# Altium project LGE_670W_L6790A Single Stage PFC LLC TV Power.PrjPcb
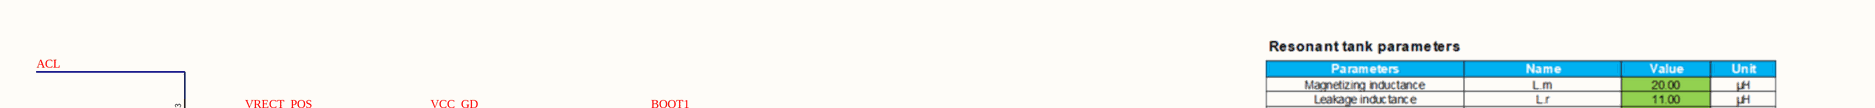
[diagram p0: L6790A_GaN.SchDoc, top left]
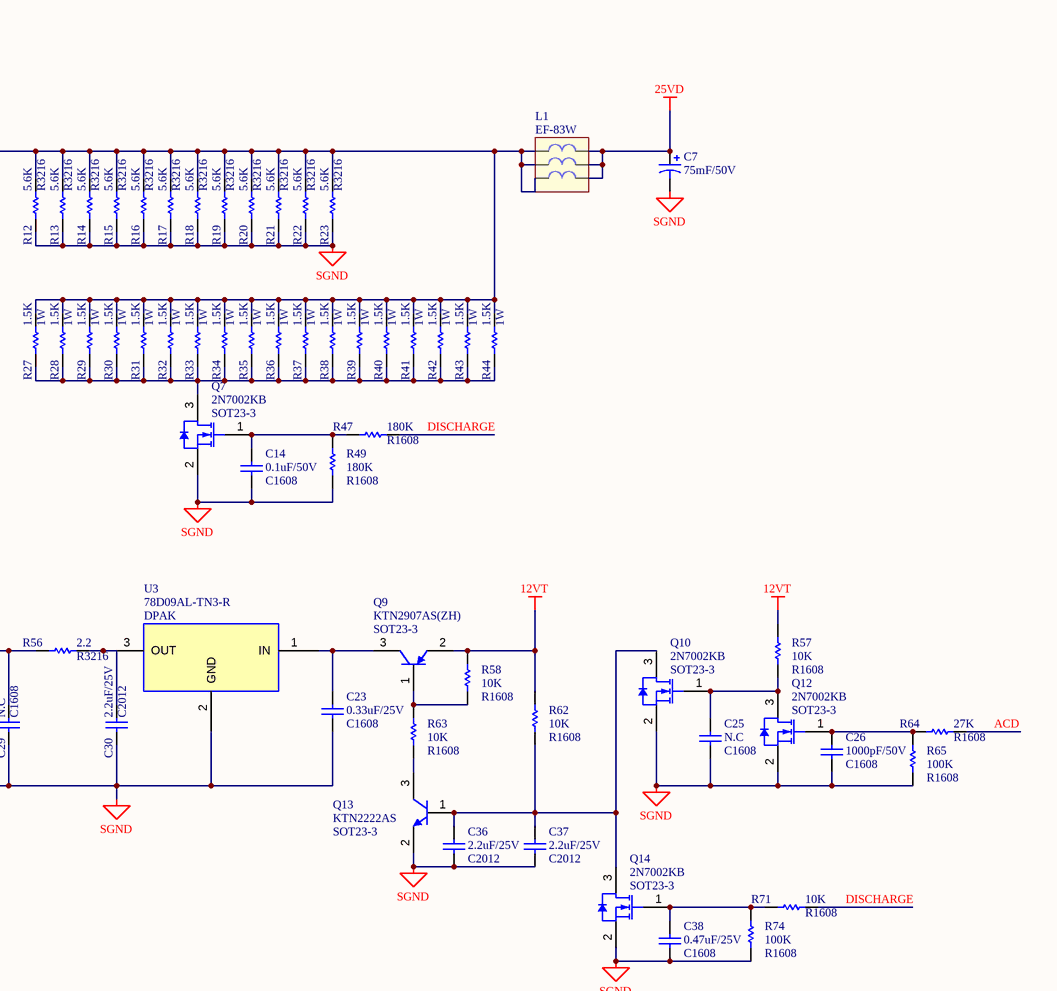
[diagram p1: L6790A_GaN.SchDoc, top right]
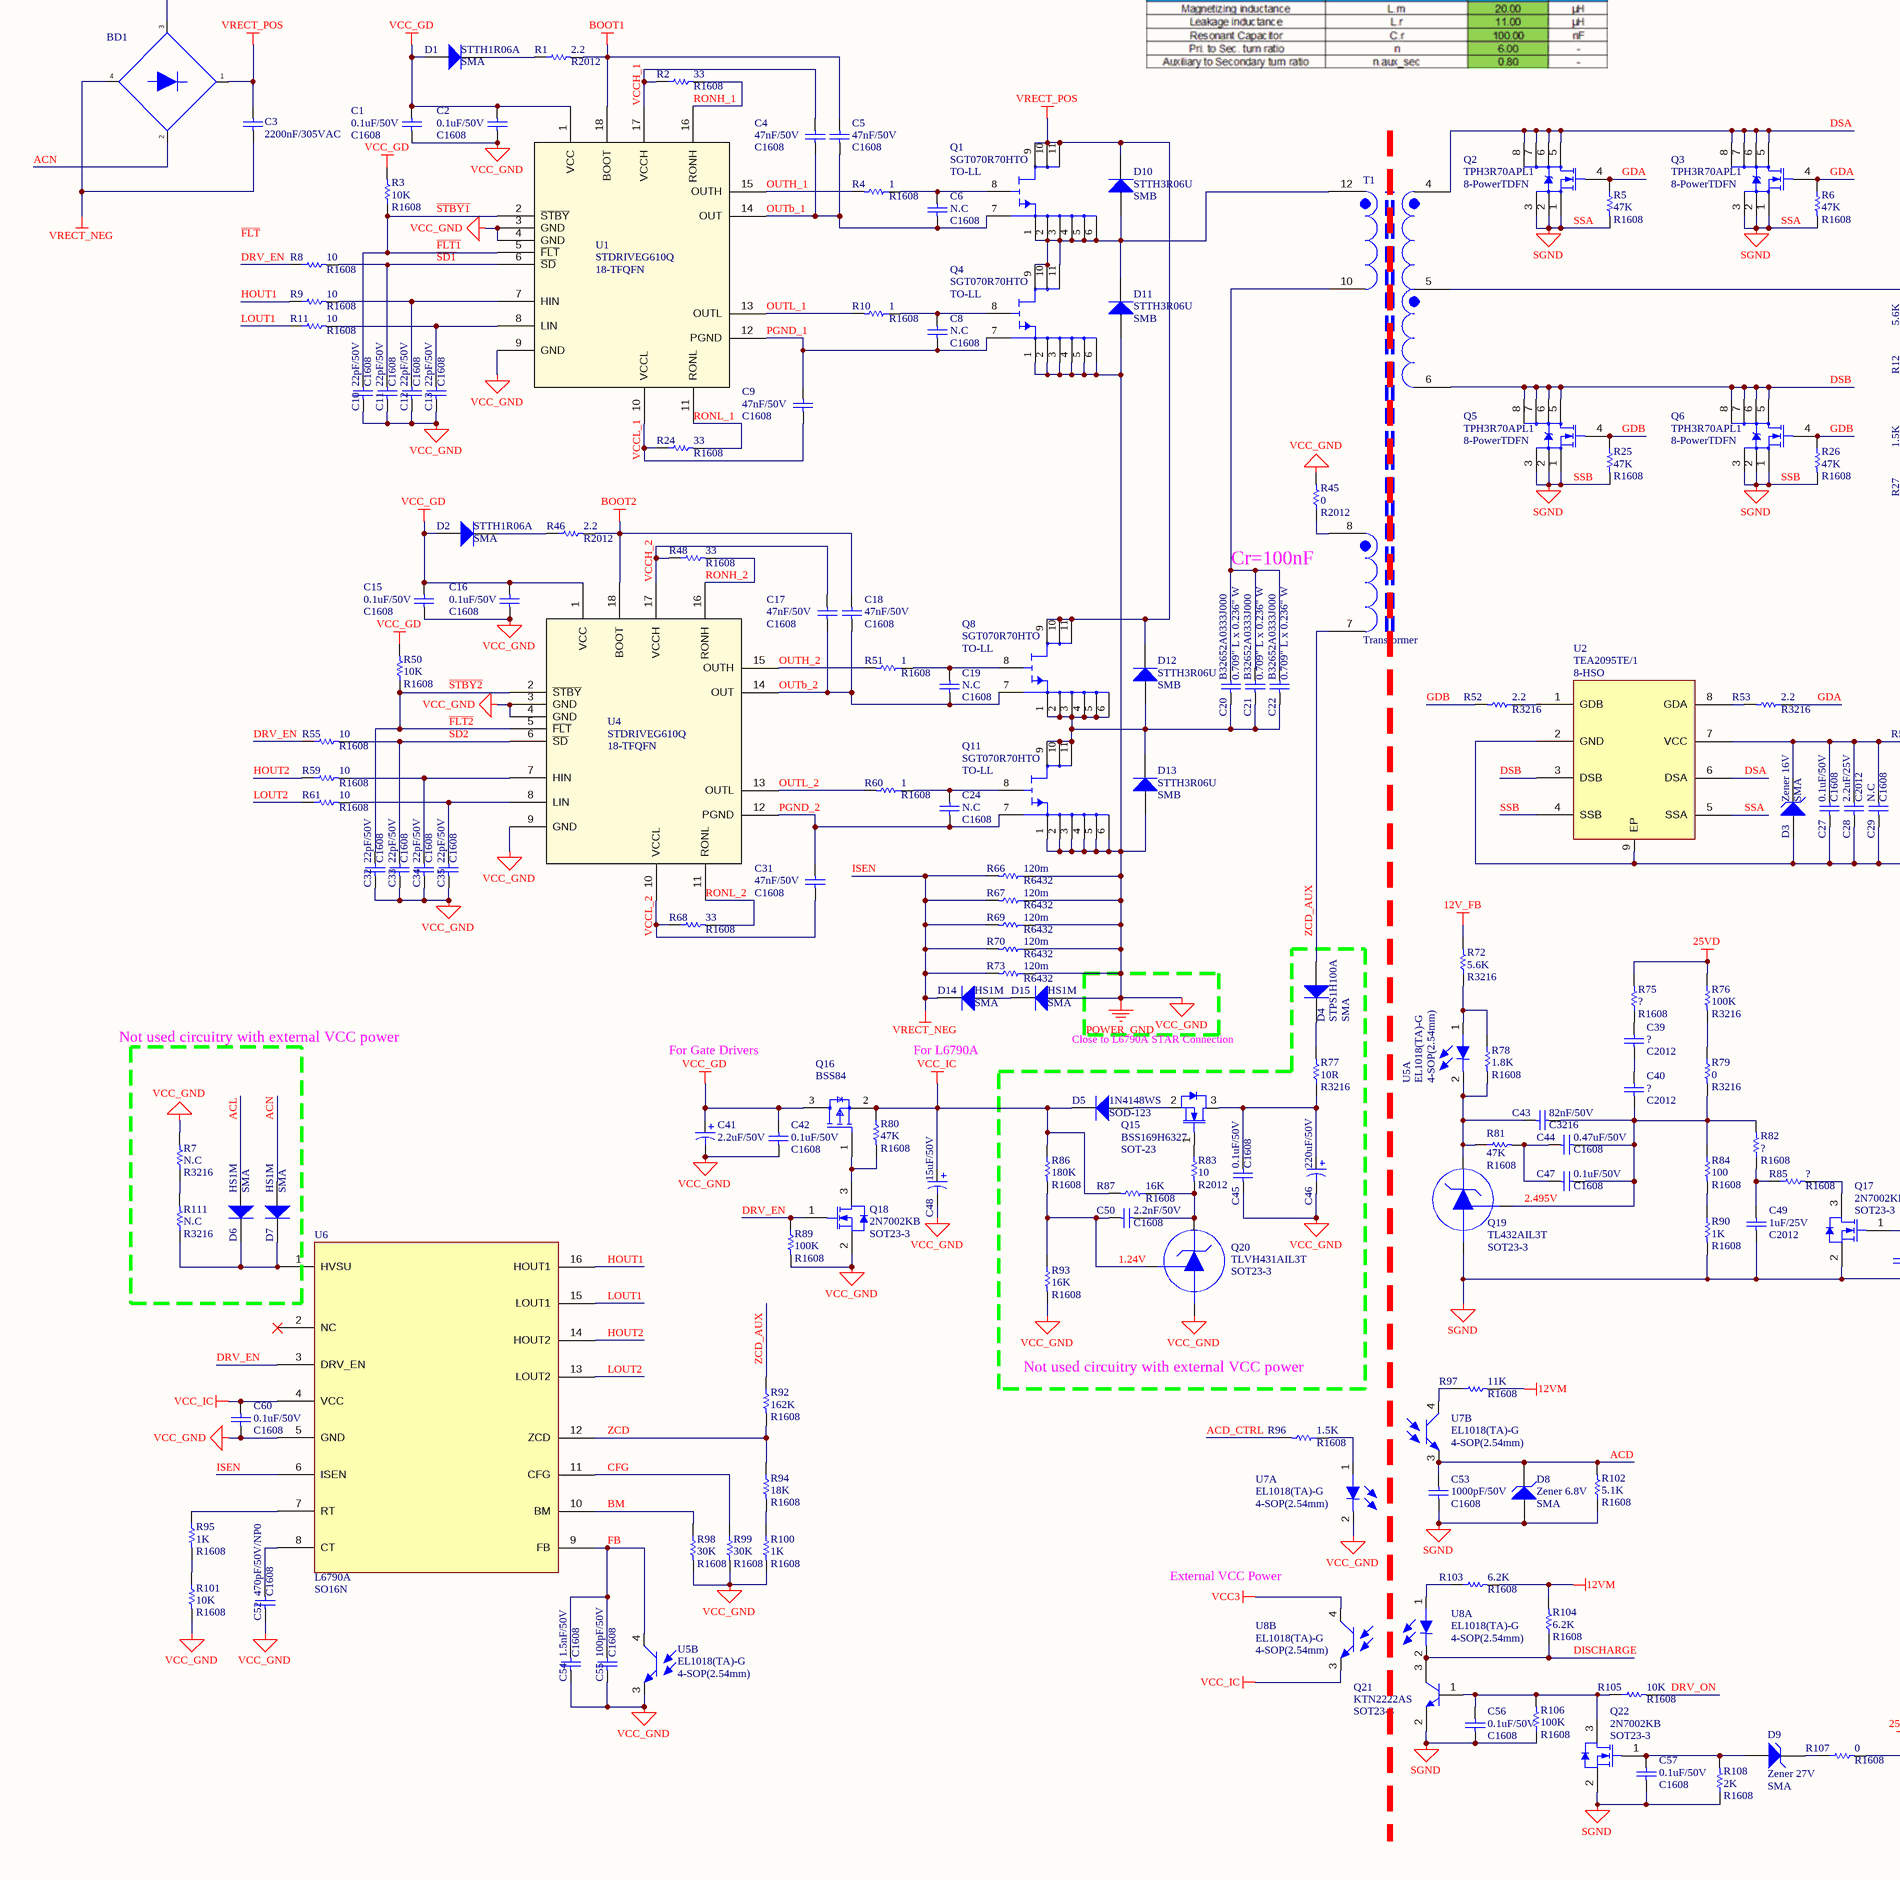
[diagram p2: L6790A_GaN.SchDoc, bottom left]
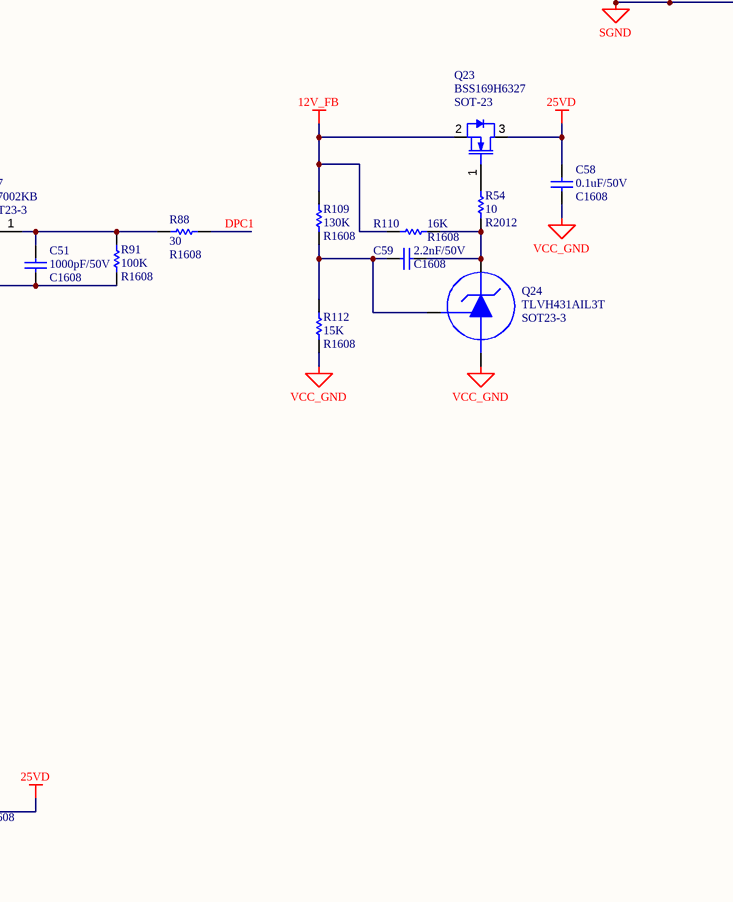
[diagram p3: L6790A_GaN.SchDoc, bottom right]
2 sheets, 445 parts. Net scope: global (net labels, ports and power ports of the same name join across sheets).
Sheets:
  L6790A_GaN.SchDoc
  L6790A_Si.SchDoc

## Sheet L6790A_GaN.SchDoc
size 594 x 420 mm; Author: Frank KWON; CompanyName: STMicroelectronics; DrawnBy: Frank KWON; Engineer: Frank KWON; Organization: AM&S APeC Korea; SheetNumber: 1; SheetTotal: 2

### Parts
BD1  TS6KL60  [2W-DIO-MI-4L-4_6X25X15-7_5P-BD]  (value not drawn)
C1  0.1uF/50V  Package/Case: C1608
C2  0.1uF/50V  Package/Case: C1608
C3  2200nF/305VAC
C4  47nF/50V  Package/Case: C1608
C5  47nF/50V  Package/Case: C1608
C6  N.C  Package/Case: C1608
C7  75mF/50V  [1W-CAP-MI-2L-16DX25-7_5P-EL-F-R1212]
C8  N.C  Package/Case: C1608
C9  47nF/50V  Package/Case: C1608
C10  22pF/50V  Package/Case: C1608
C11  22pF/50V  Package/Case: C1608
C12  22pF/50V  Package/Case: C1608
C13  22pF/50V  Package/Case: C1608
C14  0.1uF/50V  Package/Case: C1608
C15  0.1uF/50V  Package/Case: C1608
C16  0.1uF/50V  Package/Case: C1608
C17  47nF/50V  Package/Case: C1608
C18  47nF/50V  Package/Case: C1608
C19  N.C  Package/Case: C1608
C20  B32652A0333J000  Package/Case: 0.709" L x 0.236" W
C21  B32652A0333J000  Package/Case: 0.709" L x 0.236" W
C22  B32652A0333J000  Package/Case: 0.709" L x 0.236" W
C23  0.33uF/25V  Package/Case: C1608
C24  N.C  Package/Case: C1608
C25  N.C  Package/Case: C1608
C26  1000pF/50V  Package/Case: C1608
C27  0.1uF/50V  Package/Case: C1608
C28  2.2uF/25V  Package/Case: C2012
C29  N.C  Package/Case: C1608
C30  2.2uF/25V  Package/Case: C2012
C31  47nF/50V  Package/Case: C1608
C32  22pF/50V  Package/Case: C1608
C33  22pF/50V  Package/Case: C1608
C34  22pF/50V  Package/Case: C1608
C35  22pF/50V  Package/Case: C1608
C36  2.2uF/25V  Package/Case: C2012
C37  2.2uF/25V  Package/Case: C2012
C38  0.47uF/25V  Package/Case: C1608
C39  ?  Package/Case: C2012
C40  ?  Package/Case: C2012
C41  2.2uF/50V  [CAP-RA-D5.0H12_5-P2-R0CA]
C42  0.1uF/50V  Package/Case: C1608
C43  82nF/50V  Package/Case: C3216  [CAP-CHP-3216-R0]
C44  0.47uF/50V  Package/Case: C1608
C45  0.1uF/50V  Package/Case: C1608
C46  220uF/50V  [CAP-RA-D8H5-P2_5-R0]
C47  0.1uF/50V  Package/Case: C1608
C48  15uF/50V  [CAP-RA-D5.0H12_5-P2-R0CA]
C49  1uF/25V  Package/Case: C2012
C50  2.2nF/50V  Package/Case: C1608
C51  1000pF/50V  Package/Case: C1608
C52  470pF/50V/NP0  Package/Case: C1608
C53  1000pF/50V  Package/Case: C1608
C54  1.5nF/50V  Package/Case: C1608
C55  100pF/50V  Package/Case: C1608
C56  0.1uF/50V  Package/Case: C1608
C57  0.1uF/50V  Package/Case: C1608
C58  0.1uF/50V  Package/Case: C1608
C59  2.2nF/50V  Package/Case: C1608
C60  0.1uF/50V  Package/Case: C1608
D1  STTH1R06A  Package/Case: SMA  [DIO-SOD123]
D2  STTH1R06A  Package/Case: SMA  [DIO-SOD123]
D3  Zener 16V  Package/Case: SMA  [1W-DIO-CHP-2L-SOD106-SMA]
D4  STPS1H100A  Package/Case: SMA  [FP-6_560-5005_01-4-IPC_A]
D5  1N4148WS  Package/Case: SOD-123  [DIO-SOD123]
D6  HS1M  Package/Case: SMA  [DIO-SOD123]
D7  HS1M  Package/Case: SMA  [DIO-SOD123]
D8  Zener 6.8V  Package/Case: SMA  [1W-DIO-CHP-2L-SOD106-SMA]
D9  Zener 27V  Package/Case: SMA  [1W-DIO-CHP-2L-SOD106-SMA]
D10  STTH3R06U  Package/Case: SMB  [DIO-SOD123]
D11  STTH3R06U  Package/Case: SMB  [DIO-SOD123]
D12  STTH3R06U  Package/Case: SMB  [DIO-SOD123]
D13  STTH3R06U  Package/Case: SMB  [DIO-SOD123]
D14  HS1M  Package/Case: SMA  [DIO-SOD123]
D15  HS1M  Package/Case: SMA  [DIO-SOD123]
L1  EF-83W
Q1  SGT070R70HTO  Package/Case: TO-LL
Q2  TPH3R70APL1  Package/Case: 8-PowerTDFN
Q3  TPH3R70APL1  Package/Case: 8-PowerTDFN
Q4  SGT070R70HTO  Package/Case: TO-LL
Q5  TPH3R70APL1  Package/Case: 8-PowerTDFN
Q6  TPH3R70APL1  Package/Case: 8-PowerTDFN
Q7  2N7002KB  Package/Case: SOT23-3
Q8  SGT070R70HTO  Package/Case: TO-LL
Q9  KTN2907AS(ZH)  Package/Case: SOT23-3
Q10  2N7002KB  Package/Case: SOT23-3
Q11  SGT070R70HTO  Package/Case: TO-LL
Q12  2N7002KB  Package/Case: SOT23-3
Q13  KTN2222AS  Package/Case: SOT23-3
Q14  2N7002KB  Package/Case: SOT23-3
Q15  BSS169H6327  Package/Case: SOT-23  [SOT-23_TR]
Q16  BSS84  [FP-318-08-IPC_A]
Q17  2N7002KB  Package/Case: SOT23-3
Q18  2N7002KB  Package/Case: SOT23-3
Q19  TL432AIL3T  Package/Case: SOT23-3  [SOT-23_TR]
Q20  TLVH431AIL3T  Package/Case: SOT23-3  [SOT-23_TR]
Q21  KTN2222AS  Package/Case: SOT23-3
Q22  2N7002KB  Package/Case: SOT23-3
Q23  BSS169H6327  Package/Case: SOT-23  [SOT-23_TR]
Q24  TLVH431AIL3T  Package/Case: SOT23-3  [SOT-23_TR]
R1  2.2  Package/Case: R2012  [RES-1608]
R2  33  Package/Case: R1608  [RES-1608]
R3  10K  Package/Case: R1608  [RES-1608]
R4  1  Package/Case: R1608  [RES-1608]
R5  47K  Package/Case: R1608  [RES-1608]
R6  47K  Package/Case: R1608  [RES-1608]
R7  N.C  Package/Case: R3216  [RES-3216]
R8  10  Package/Case: R1608  [RES-1608]
R9  10  Package/Case: R1608  [RES-1608]
R10  1  Package/Case: R1608  [RES-1608]
R11  10  Package/Case: R1608  [RES-1608]
R12  5.6K  Package/Case: R3216  [RES-3216]
R13  5.6K  Package/Case: R3216  [RES-3216]
R14  5.6K  Package/Case: R3216  [RES-3216]
R15  5.6K  Package/Case: R3216  [RES-3216]
R16  5.6K  Package/Case: R3216  [RES-3216]
R17  5.6K  Package/Case: R3216  [RES-3216]
R18  5.6K  Package/Case: R3216  [RES-3216]
R19  5.6K  Package/Case: R3216  [RES-3216]
R20  5.6K  Package/Case: R3216  [RES-3216]
R21  5.6K  Package/Case: R3216  [RES-3216]
R22  5.6K  Package/Case: R3216  [RES-3216]
R23  5.6K  Package/Case: R3216  [RES-3216]
R24  33  Package/Case: R1608  [RES-1608]
R25  47K  Package/Case: R1608  [RES-1608]
R26  47K  Package/Case: R1608  [RES-1608]
R27  1.5K  Package/Case: 1W
R28  1.5K  Package/Case: 1W
R29  1.5K  Package/Case: 1W
R30  1.5K  Package/Case: 1W
R31  1.5K  Package/Case: 1W
R32  1.5K  Package/Case: 1W
R33  1.5K  Package/Case: 1W
R34  1.5K  Package/Case: 1W
R35  1.5K  Package/Case: 1W
R36  1.5K  Package/Case: 1W
R37  1.5K  Package/Case: 1W
R38  1.5K  Package/Case: 1W
R39  1.5K  Package/Case: 1W
R40  1.5K  Package/Case: 1W
R41  1.5K  Package/Case: 1W
R42  1.5K  Package/Case: 1W
R43  1.5K  Package/Case: 1W
R44  1.5K  Package/Case: 1W
R45  0  Package/Case: R2012  [RES-1608]
R46  2.2  Package/Case: R2012  [RES-1608]
R47  180K  Package/Case: R1608  [RES-1608]
R48  33  Package/Case: R1608  [RES-1608]
R49  180K  Package/Case: R1608  [RES-1608]
R50  10K  Package/Case: R1608  [RES-1608]
R51  1  Package/Case: R1608  [RES-1608]
R52  2.2  Package/Case: R3216  [RES-3216]
R53  2.2  Package/Case: R3216  [RES-3216]
R54  10  Package/Case: R2012  [RES-1608]
R55  10  Package/Case: R1608  [RES-1608]
R56  2.2  Package/Case: R3216  [RES-3216]
R57  10K  Package/Case: R1608  [RES-1608]
R58  10K  Package/Case: R1608  [RES-1608]
R59  10  Package/Case: R1608  [RES-1608]
R60  1  Package/Case: R1608  [RES-1608]
R61  10  Package/Case: R1608  [RES-1608]
R62  10K  Package/Case: R1608  [RES-1608]
R63  10K  Package/Case: R1608  [RES-1608]
R64  27K  Package/Case: R1608  [RES-1608]
R65  100K  Package/Case: R1608  [RES-1608]
R66  120m  Package/Case: R6432
R67  120m  Package/Case: R6432
R68  33  Package/Case: R1608  [RES-1608]
R69  120m  Package/Case: R6432
R70  120m  Package/Case: R6432
R71  10K  Package/Case: R1608  [RES-1608]
R72  5.6K  Package/Case: R3216  [RES-3216]
R73  120m  Package/Case: R6432
R74  100K  Package/Case: R1608  [RES-1608]
R75  ?  Package/Case: R1608  [RES-1608]
R76  100K  Package/Case: R3216  [RES-3216]
R77  10R  Package/Case: R3216  [RES-3216]
R78  1.8K  Package/Case: R1608  [RES-1608]
R79  0  Package/Case: R3216  [RES-3216]
R80  47K  Package/Case: R1608  [RES-1608]
R81  47K  Package/Case: R1608  [RES-1608]
R82  ?  Package/Case: R1608  [RES-1608]
R83  10  Package/Case: R2012  [RES-1608]
R84  100  Package/Case: R1608  [RES-1608]
R85  ?  Package/Case: R1608  [RES-1608]
R86  180K  Package/Case: R1608  [RES-1608]
R87  16K  Package/Case: R1608  [RES-1608]
R88  30  Package/Case: R1608  [RES-1608]
R89  100K  Package/Case: R1608  [RES-1608]
R90  1K  Package/Case: R1608  [RES-1608]
R91  100K  Package/Case: R1608  [RES-1608]
R92  162K  Package/Case: R1608  [RES-1608]
R93  16K  Package/Case: R1608  [RES-1608]
R94  18K  Package/Case: R1608  [RES-1608]
R95  1K  Package/Case: R1608  [RES-1608]
R96  1.5K  Package/Case: R1608  [RES-1608]
R97  11K  Package/Case: R1608  [RES-1608]
R98  30K  Package/Case: R1608  [RES-1608]
R99  30K  Package/Case: R1608  [RES-1608]
R100  1K  Package/Case: R1608  [RES-1608]
R101  10K  Package/Case: R1608  [RES-1608]
R102  5.1K  Package/Case: R1608  [RES-1608]
R103  6.2K  Package/Case: R1608  [RES-1608]
R104  6.2K  Package/Case: R1608  [RES-1608]
R105  10K  Package/Case: R1608  [RES-1608]
R106  100K  Package/Case: R1608  [RES-1608]
R107  0  Package/Case: R1608  [RES-1608]
R108  2K  Package/Case: R1608  [RES-1608]
R109  130K  Package/Case: R1608  [RES-1608]
R110  16K  Package/Case: R1608  [RES-1608]
R111  N.C  Package/Case: R3216  [RES-3216]
R112  15K  Package/Case: R1608  [RES-1608]
T1  Transformer
U1  STDRIVEG610Q  Package/Case: 18-TFQFN
U2  TEA2095TE/1  Package/Case: 8-HSO
U3  78D09AL-TN3-R  Package/Case: DPAK
U4  STDRIVEG610Q  Package/Case: 18-TFQFN
U5  EL1018(TA)-G  Package/Case: 4-SOP(2.54mm)  [1W-IC-CHP-4L-3_6X7_6-2_54P-L10_2-PC]  (parts A,B of 2)
U6  L6790A  Package/Case: SO16N
U7  EL1018(TA)-G  Package/Case: 4-SOP(2.54mm)  [1W-IC-CHP-4L-3_6X7_6-2_54P-L10_2-PC]  (parts A,B of 2)
U8  EL1018(TA)-G  Package/Case: 4-SOP(2.54mm)  [1W-IC-CHP-4L-3_6X7_6-2_54P-L10_2-PC]  (parts A,B of 2)

### Blocks framed on the sheet
Not used circuitry with external VCC power: C45 C46 C50 D4 D5 Q15 Q20 R77 R83 R86 R87 R93

### Nets
12V_FB: Q23.2(SOURCE) R72.2 R109.1 R110.2
12VM: R97.2 R103.2 R104.2
12VT: Q9.2(E) R57.1 R58.1 R62.1
25VD: C7.1 C58.1 L1.2 Q23.3(DRAIN) R75.2 R76.1 R107.2
BOOT1: C5.1 R1.2 U1.18(BOOT)
BOOT2: C18.1 R46.2 U4.18(BOOT)
ISEN: BD1.4 C3.1 D14.2(K) R66.2 R67.2 R69.2 R70.2 R73.2 U6.6(ISEN)  [also labelled VRECT_NEG]
POWER_GND: C1.2 C2.2 C10.2 C11.2 C12.2 C13.2 C15.2 C16.2 C32.2 C33.2 C34.2 C35.2 C41.2 C42.2 C45.2 C46.2 C48.2 C52.2 C54.2 C55.2 C58.2 C60.2 D11.1(A) D13.1(A) D15.1(A) Q4.1(S) Q4.2(S) Q4.3(S) Q4.4(S) Q4.5(S) Q4.6(S) Q11.1(S) Q11.2(S) Q11.3(S) Q11.4(S) Q11.5(S) Q11.6(S) Q18.2(S) Q20.3(A) Q24.3(A) R7.2 R45.2 R66.1 R67.1 R69.1 R70.1 R73.1 R89.2 R93.2 R98.2 R99.2 R100.2 R101.2 R112.2 U1.3(GND) U1.4(GND) U1.9(GND) U4.3(GND) U4.4(GND) U4.9(GND) U5.3(E) U6.5(GND) U7.2(C)  [also labelled VCC_GND]
SSA: C7.2 C14.2 C23.2 C25.2 C26.2 C27.2 C28.2 C29.2 C30.2 C36.2 C37.2 C38.2 C49.2 C51.2 C53.2 C56.1 C57.1 D3.1(A) D8.1(A) Q2.1(S) Q2.2(S) Q2.3(S) Q3.1(S) Q3.2(S) Q3.3(S) Q5.1(S) Q5.2(S) Q5.3(S) Q6.1(S) Q6.2(S) Q6.3(S) Q7.2(S) Q10.2(S) Q12.2(S) Q13.2(E) Q14.2(S) Q17.2(S) Q19.3(A) Q21.2(E) Q22.2(S) R5.2 R6.2 R12.1 R13.1 R14.1 R15.1 R16.1 R17.1 R18.1 R19.1 R20.1 R21.1 R22.1 R23.1 R25.2 R26.2 R49.2 R65.2 R74.2 R90.2 R91.1 R102.1 R106.1 R108.1 U2.2(GND) U2.4(SSB) U2.5(SSA) U2.9(EP) U3.2(GND)  [also labelled SGND, SSB]
VCC3: U8.4(C)
VCC_GD: C1.1 C2.1 C15.1 C16.1 C41.1 C42.1 D1.1(A) D2.1(A) Q16.3(D) R3.2 R50.2 U1.1(VCC) U4.1(VCC)
VCC_IC: C48.1 C60.1 D5.2(K) Q16.2(S) R80.1 R86.1 R87.2 U6.4(VCC) U8.3(E)
VRECT_POS: BD1.1 C3.2 D10.2(K) D12.2(K) Q1.9(D) Q1.10(D) Q1.11(D) Q8.9(D) Q8.10(D) Q8.11(D)
1.24V: C50.1 Q20.1(R) R86.2 R93.1
2.495V: C40.2 C43.1 C44.1 C47.1 Q19.1(R) R79.2 R82.2 R84.1
~{FLT1}: C10.1 R3.1 U1.2(~{STBY}) U1.5(~{FLT})  [also labelled ~{STBY1}]
~{FLT2}: C32.1 R50.1 U4.2(~{STBY}) U4.5(~{FLT})  [also labelled ~{STBY2}]
~{SD1}: C11.1 R8.2 U1.6(~{SD})
~{SD2}: C33.1 R55.2 U4.6(~{SD})
ACD: C53.1 D8.2(K) R64.2 R102.2 U7.3(E)
ACD_CTRL: R96.2
ACL: BD1.3 D6.1(A)
ACN: BD1.2 D7.1(A)
BM: R98.1 U6.10(BM)
CFG: R99.1 U6.11(CFG)
DISCHARGE: Q21.3(C) R47.2 R71.2 R104.1 U8.2(C)
DPC1: R88.2
DRV_EN: Q18.1(G) R8.1 R55.1 R89.1 U6.3(DRV_EN)
DRV_ON: R105.2
DSA: Q2.5(D) Q2.6(D) Q2.7(D) Q2.8(D) Q3.5(D) Q3.6(D) Q3.7(D) Q3.8(D) T1.4 U2.6(DSA)
DSB: Q5.5(D) Q5.6(D) Q5.7(D) Q5.8(D) Q6.5(D) Q6.6(D) Q6.7(D) Q6.8(D) T1.6 U2.3(DSB)
FB: C54.1 C55.1 U5.4(C) U6.9(FB)
GDA: Q2.4(G) Q3.4(G) R5.1 R6.1 R53.1
GDB: Q5.4(G) Q6.4(G) R25.1 R26.1 R52.2
HOUT1: R9.1 U6.16(HOUT1)
HOUT2: R59.1 U6.14(HOUT2)
LOUT1: R11.1 U6.15(LOUT1)
LOUT2: R61.1 U6.13(LOUT2)
OUTb_1: C4.2 C5.2 C6.2 Q1.7(KS) U1.14(OUT)
OUTb_2: C17.2 C18.2 C19.2 Q8.7(KS) U4.14(OUT)
OUTH_1: R4.2 U1.15(OUTH)
OUTH_2: R51.2 U4.15(OUTH)
OUTL_1: R10.2 U1.13(OUTL)
OUTL_2: R60.2 U4.13(OUTL)
PGND_1: C8.2 C9.1 Q4.7(KS) U1.12(PGND)
PGND_2: C24.2 C31.1 Q11.7(KS) U4.12(PGND)
RONH_1: R2.2 U1.16(RONH)
RONH_2: R48.2 U4.16(RONH)
RONL_1: R24.2 U1.11(RONL)
RONL_2: R68.2 U4.11(RONL)
VCCH_1: C4.1 R2.1 U1.17(VCCH)
VCCH_2: C17.1 R48.1 U4.17(VCCH)
VCCL_1: C9.2 R24.1 U1.10(VCCL)
VCCL_2: C31.2 R68.1 U4.10(VCCL)
ZCD: R92.2 R94.1 U6.12(ZCD)
ZCD_AUX: D4.1(A) R92.1 T1.7
NetC6_1: C6.1 Q1.8(G) R4.1
NetC8_1: C8.1 Q4.8(G) R10.1
NetC12_1: C12.1 R9.2 U1.7(HIN)
NetC13_1: C13.1 R11.2 U1.8(LIN)
NetC14_1: C14.1 Q7.1(G) R47.1 R49.1
NetC19_1: C19.1 Q8.8(G) R51.1
NetC20_1: C20.1 C21.1 C22.1 T1.10
NetC20_2: C20.2 C21.2 C22.2 D12.1(A) D13.2(K) Q8.1(S) Q8.2(S) Q8.3(S) Q8.4(S) Q8.5(S) Q8.6(S) Q11.9(D) Q11.10(D) Q11.11(D)
NetC23_1: C23.1 Q9.3(C) U3.1(IN)
NetC24_1: C24.1 Q11.8(G) R60.1
NetC25_1: C25.1 Q10.1(G) Q12.3(D) R57.2
NetC26_1: C26.1 Q12.1(G) R64.1 R65.1
NetC27_1: C27.1 C28.1 C29.1 D3.2(K) R56.2 U2.7(VCC)
NetC30_1: C30.1 R56.1 U3.3(OUT)
NetC34_1: C34.1 R59.2 U4.7(HIN)
NetC35_1: C35.1 R61.2 U4.8(LIN)
NetC36_1: C36.1 C37.1 Q10.3(D) Q13.1(B) Q14.3(D) R62.2
NetC38_1: C38.1 Q14.1(G) R71.1 R74.1
NetC39_1: C39.1 R75.1
NetC39_2: C39.2 C40.1
NetC43_2: C43.2 Q19.2(K) R78.2 R81.1 U5.2(C)
NetC44_2: C44.2 C47.2 R81.2
NetC45_1: C45.1 C46.1 Q15.3(DRAIN) R77.1
NetC49_1: C49.1 R82.1 R85.1
NetC50_2: C50.2 Q20.2(K) R83.2 R87.1
NetC51_1: C51.1 Q17.1(G) R88.1 R91.2
NetC52_1: C52.1 U6.8(CT)
NetC56_2: C56.2 Q21.1(B) Q22.3(D) R105.1 R106.2
NetC57_2: C57.2 D9.1(A) Q22.1(G) R108.2
NetC59_1: C59.1 Q24.1(R) R109.2 R112.1
NetC59_2: C59.2 Q24.2(K) R54.2 R110.1
NetD1_2: D1.2(K) R1.1
NetD2_2: D2.2(K) R46.1
NetD4_2: D4.2(K) R77.2
NetD5_1: D5.1(A) Q15.2(SOURCE)
NetD6_2: D6.2(K) D7.2(K) R111.1 U6.1(HVSU)
NetD9_2: D9.2(K) R107.1
NetD10_1: D10.1(A) D11.2(K) Q1.1(S) Q1.2(S) Q1.3(S) Q1.4(S) Q1.5(S) Q1.6(S) Q4.9(D) Q4.10(D) Q4.11(D) T1.12
NetD14_1: D14.1(A) D15.2(K)
NetL1_1: L1.1 R12.2 R13.2 R14.2 R15.2 R16.2 R17.2 R18.2 R19.2 R20.2 R21.2 R22.2 R23.2 R27.2 R28.2 R29.2 R30.2 R31.2 R32.2 R33.2 R34.2 R35.2 R36.2 R37.2 R38.2 R39.2 R40.2 R41.2 R42.2 R43.2 R44.2 T1.5
NetQ7_3: Q7.3(D) R27.1 R28.1 R29.1 R30.1 R31.1 R32.1 R33.1 R34.1 R35.1 R36.1 R37.1 R38.1 R39.1 R40.1 R41.1 R42.1 R43.1 R44.1
NetQ9_1: Q9.1(B) R58.2 R63.1
NetQ13_3: Q13.3(C) R63.2
NetQ15_1: Q15.1(GATE) R83.1
NetQ16_1: Q16.1(G) Q18.3(D) R80.2
NetQ17_3: Q17.3(D) R85.2
NetQ23_1: Q23.1(GATE) R54.1
NetR7_1: R7.1 R111.2
NetR45_1: R45.1 T1.8
NetR52_1: R52.1 U2.1(GDB)
NetR53_2: R53.2 U2.8(GDA)
NetR72_1: R72.1 R78.1 U5.1(A)
NetR76_2: R76.2 R79.1
NetR84_2: R84.2 R90.1
NetR94_2: R94.2 R100.1
NetR95_1: R95.1 U6.7(RT)
NetR95_2: R95.2 R101.1
NetR96_1: R96.1 U7.1(A)
NetR97_1: R97.1 U7.4(C)
NetR103_1: R103.1 U8.1(A)

Not connected (* = marked no-connect by the designer): U6 2(NC)*

### Notes on the sheet
- Cr=100nF
- Not used circuitry with external VCC power
- For Gate Drivers
- For L6790A
- Close to L6790A STAR Connection
- External VCC Power
- Labels drawn without touching a wire or pin: ~{FLT}
- DWG NO:
- REV:
- THIS DOCUMENT AND THE DATA DISCLOSED HEREIN OR
- HEREWITH IS THE PROPERTY OF ALTIUM LIMITED AND MAY
- BE FREELY DISTRIBUTED IN WHOLE. NO RIGHTS ARE
- RESERVED OR EXPRESS OR IMPLIED WARANTEE GIVEN.
- REVISION
- DESCRIPTION
- DATE
- APPROVED
- ENG:
- APPROVALS
- PROJECT
- DSN:
- CHK:
- REFERENCE DOCUMENTS
- PROJECT REVISION:
- TITLE
- DOCUMENT REVISION:
- DESIGN ITEM:
- BOM:
- FAB DWG:
- PCB DWG:
- ASSY DWG:
- SCALE:
- A2
- SIZE
- CAGE CODE
- FILE NAME
- DWG NO.
- SHEET
- OF
- REV

### Library data of the parts
BD1 = BRIDGE: BRIDGE DIODE; Mount Type: DIP
C1-C6 C8-C40 C42-C45 C47 C49-C60 = Cap: Chip MLCC
  C1-C6 C8-C38 C42 C45 C50-C60: Mounting Type: SMD
  C39 C40 C43 C44 C47 C49: Mount Type: SMD
C7 = Cap Pol1: Electrolytic Capacitor; Mount Type: DIP
C41 C48 = Cap Pol1: Electrolytic Capacitor 33uF/25V; Mount Type: DIP
C46 = Cap Pol1: Electrolytic Capacitor 22uF/100V; Mount Type: DIP
D1 D2 D5-D7 D10-D15 = Diode 1N4148: DIODE SCHOTTKY 30V 200MA SOD123; Mount Type: SMD
D3 D8 D9 = D Zener: DIODE ZENER 30V 1W DO214AC; Mount Type: SMD
D4 = Diode 1N4148: DIODE STANDARD 200V 200MA SOD80; Mount Type: SMD
Q1 Q4 Q8 Q11 = SGT070R70HTO: 700 V, 53 mΩ typ., 26 A, e-mode PowerGaN transistor; ComponentLink1URL: http://www.nexperia.com/; ComponentLink2URL: https://assets.nexperia.com/documents/data-sheet/GAN080-650EBE.pdf; Mounting Type: SMD
Q2 Q3 Q5 Q6 = TPH3R70APL1: N-Channel 100 V 90A (Tc) 210W (Tc) Surface Mount 8-SOP Advance (5x5.75); Mount Type: SMD
Q7 Q10 Q12 Q14 Q17 Q18 Q22 = 2N7002KB: N-CH MOSFET; Mounting Type: SMD
Q9 = ONSC-PNP-B1E2C3-3: PNP BJT; Mounting Type: SMD
Q13 Q21 = ONSC-NPN-B1E2C3-3: BJT NPN; Mounting Type: SMD
Q15 Q23 = CMP-32901-000982-1: MOSFET N-CH 100V 170MA SOT23-3; Mount Type: SMD
Q16 = CMP-1058-00762-2: MOSFET P-CH 50V 130MA SOT-23; Max Power Dissipation: 225mW; On-State Resistance: 10R; Nominal Vgs: 2V; Gate to Source Voltage (Vgs): 20V; Rise Time: 1ns; Turn-Off Delay Time: 16ns; Voltage Rating (DC): -50V; Turn-On Delay Time: 3.6ns; Number of Elements: 1; Current Rating: -130mA; Input Capacitance: 30pF; Threshold Voltage: -2V; Element Configuration: Single; Drain to Source Breakdown Voltage: 50V; Continuous Drain Current (ID): 130mA; Length: 0.119inch; Drain to Source Voltage (Vdss): 50V; Min Operating Temperature: -55°C; Contact Plating: Tin; Lead Free: Lead Free; Width: 0.055inch; Case/Package: SOT-23-3; Max Operating Temperature: 150°C; Halogen Free: Halogen Free; Radiation Hardening: No; Drain to Source Resistance: 10R; REACH SVHC: No SVHC; Power Dissipation: 225mW; Number of Pins: 3; Package Quantity: 1; Packaging: Tape and Reel; Fall Time: 1ns; Rds On Max: 10R; Height: 0.04inch
Q19 Q20 Q24 = 1W-IC-CHP-3L-SOT23-SCR-R0: IC VREF SHUNT ADJ 1% SOT23-3; Mount Type: SMD
R1-R26 R45-R112 = Res1: Chip Resistor; Mount Type: SMD
R27-R44 = Res1: Watt Resistor; Mount Type: SMD
U1 U4 = STDRIVEG610Q: High voltage and high-speed half-bridge gate driver for GaN power switches
U2 = TEA2095TE/1: LLC SR CONTROLLER IC; Mounting Type: SMD
U3 = 78D09AL-TN3-R: 3-TERMINALS 1A POSITIVE VOLTAGE REGULATOR; Mounting Type: SMD
U5 U7 U8 = SFH617A-2X019T: Photocoupler; Mount Type: SMD
U6 = L6790A: LLC-PFC controller IC for insulated power factor corrector application; Mounting Type: SMD
T1 = Transformer: Mount Type: DIP

## Sheet L6790A_Si.SchDoc: LG L6790A Single Stage PFC LLC
size 594 x 420 mm; Author: Frank KWON; CompanyName: STMicroelectronics; DrawnBy: Frank KWON; Engineer: Frank KWON; Organization: AM&S APeC Korea; SheetNumber: 2; SheetTotal: 2
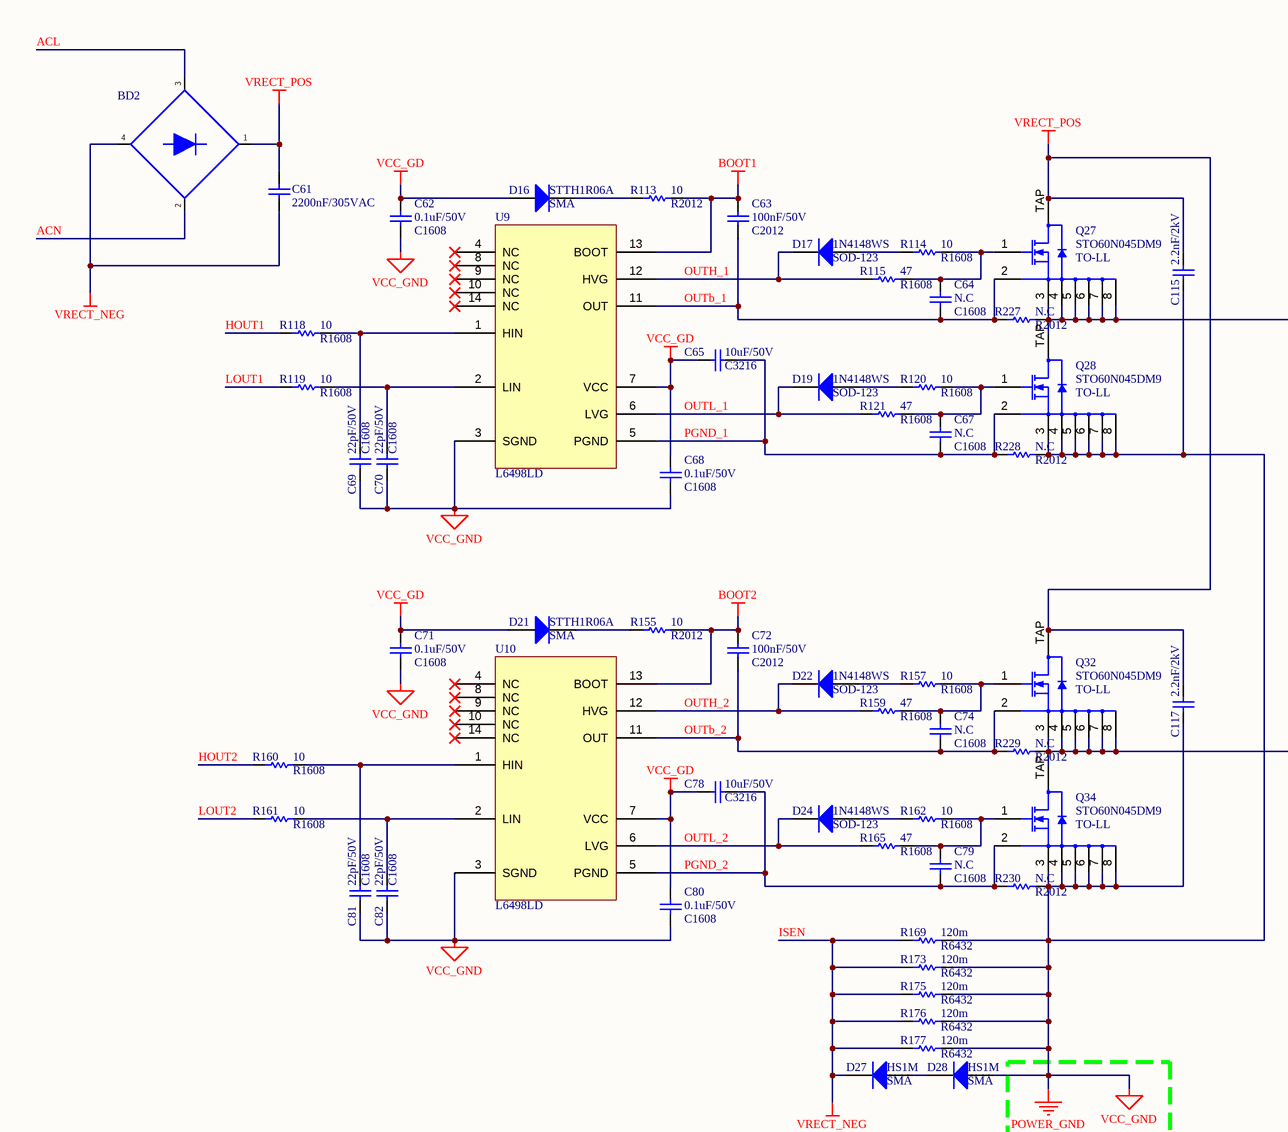
[diagram p4: L6790A_Si.SchDoc, top left]
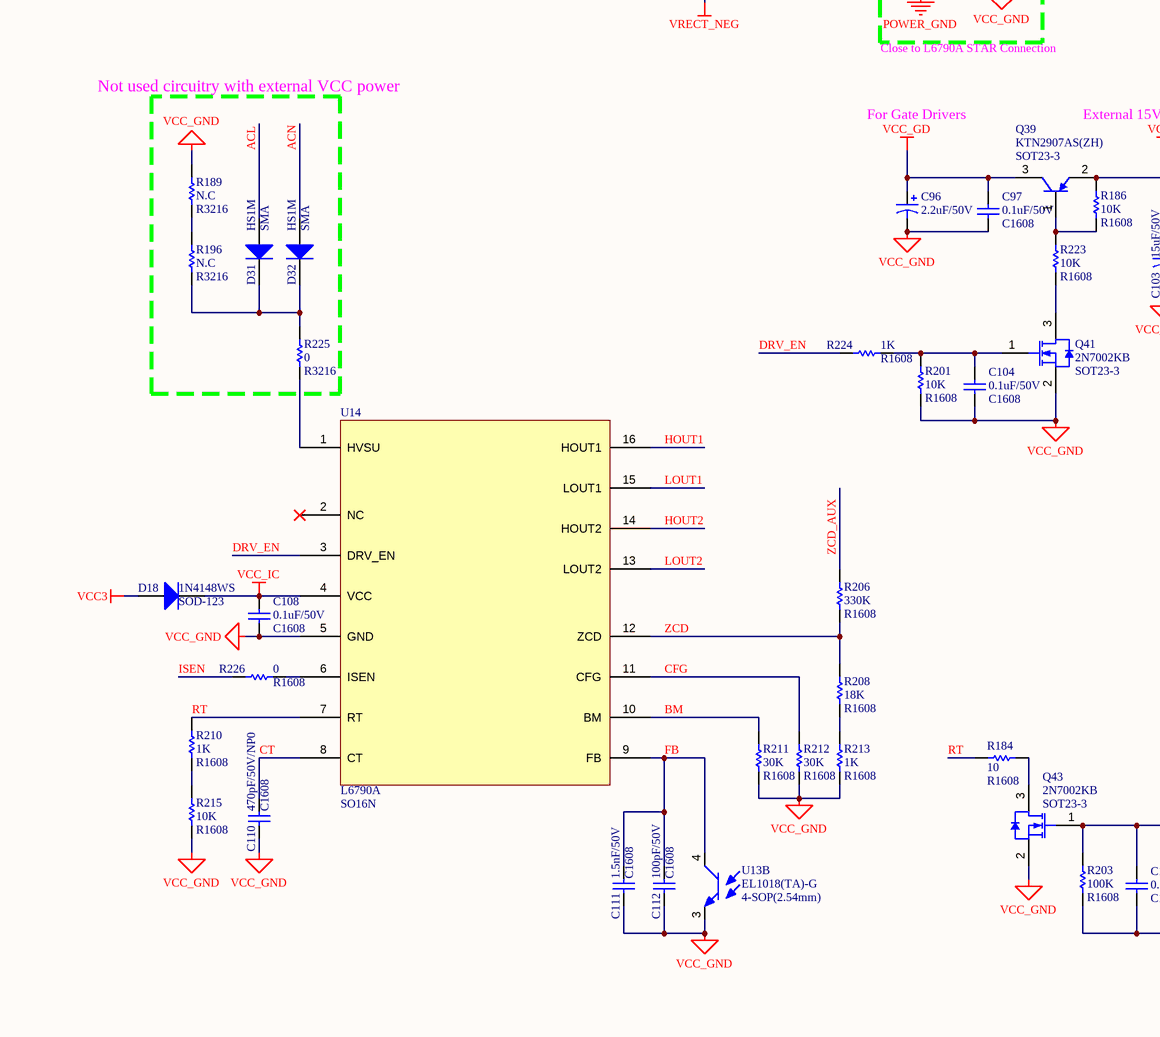
[diagram p5: L6790A_Si.SchDoc, bottom left]
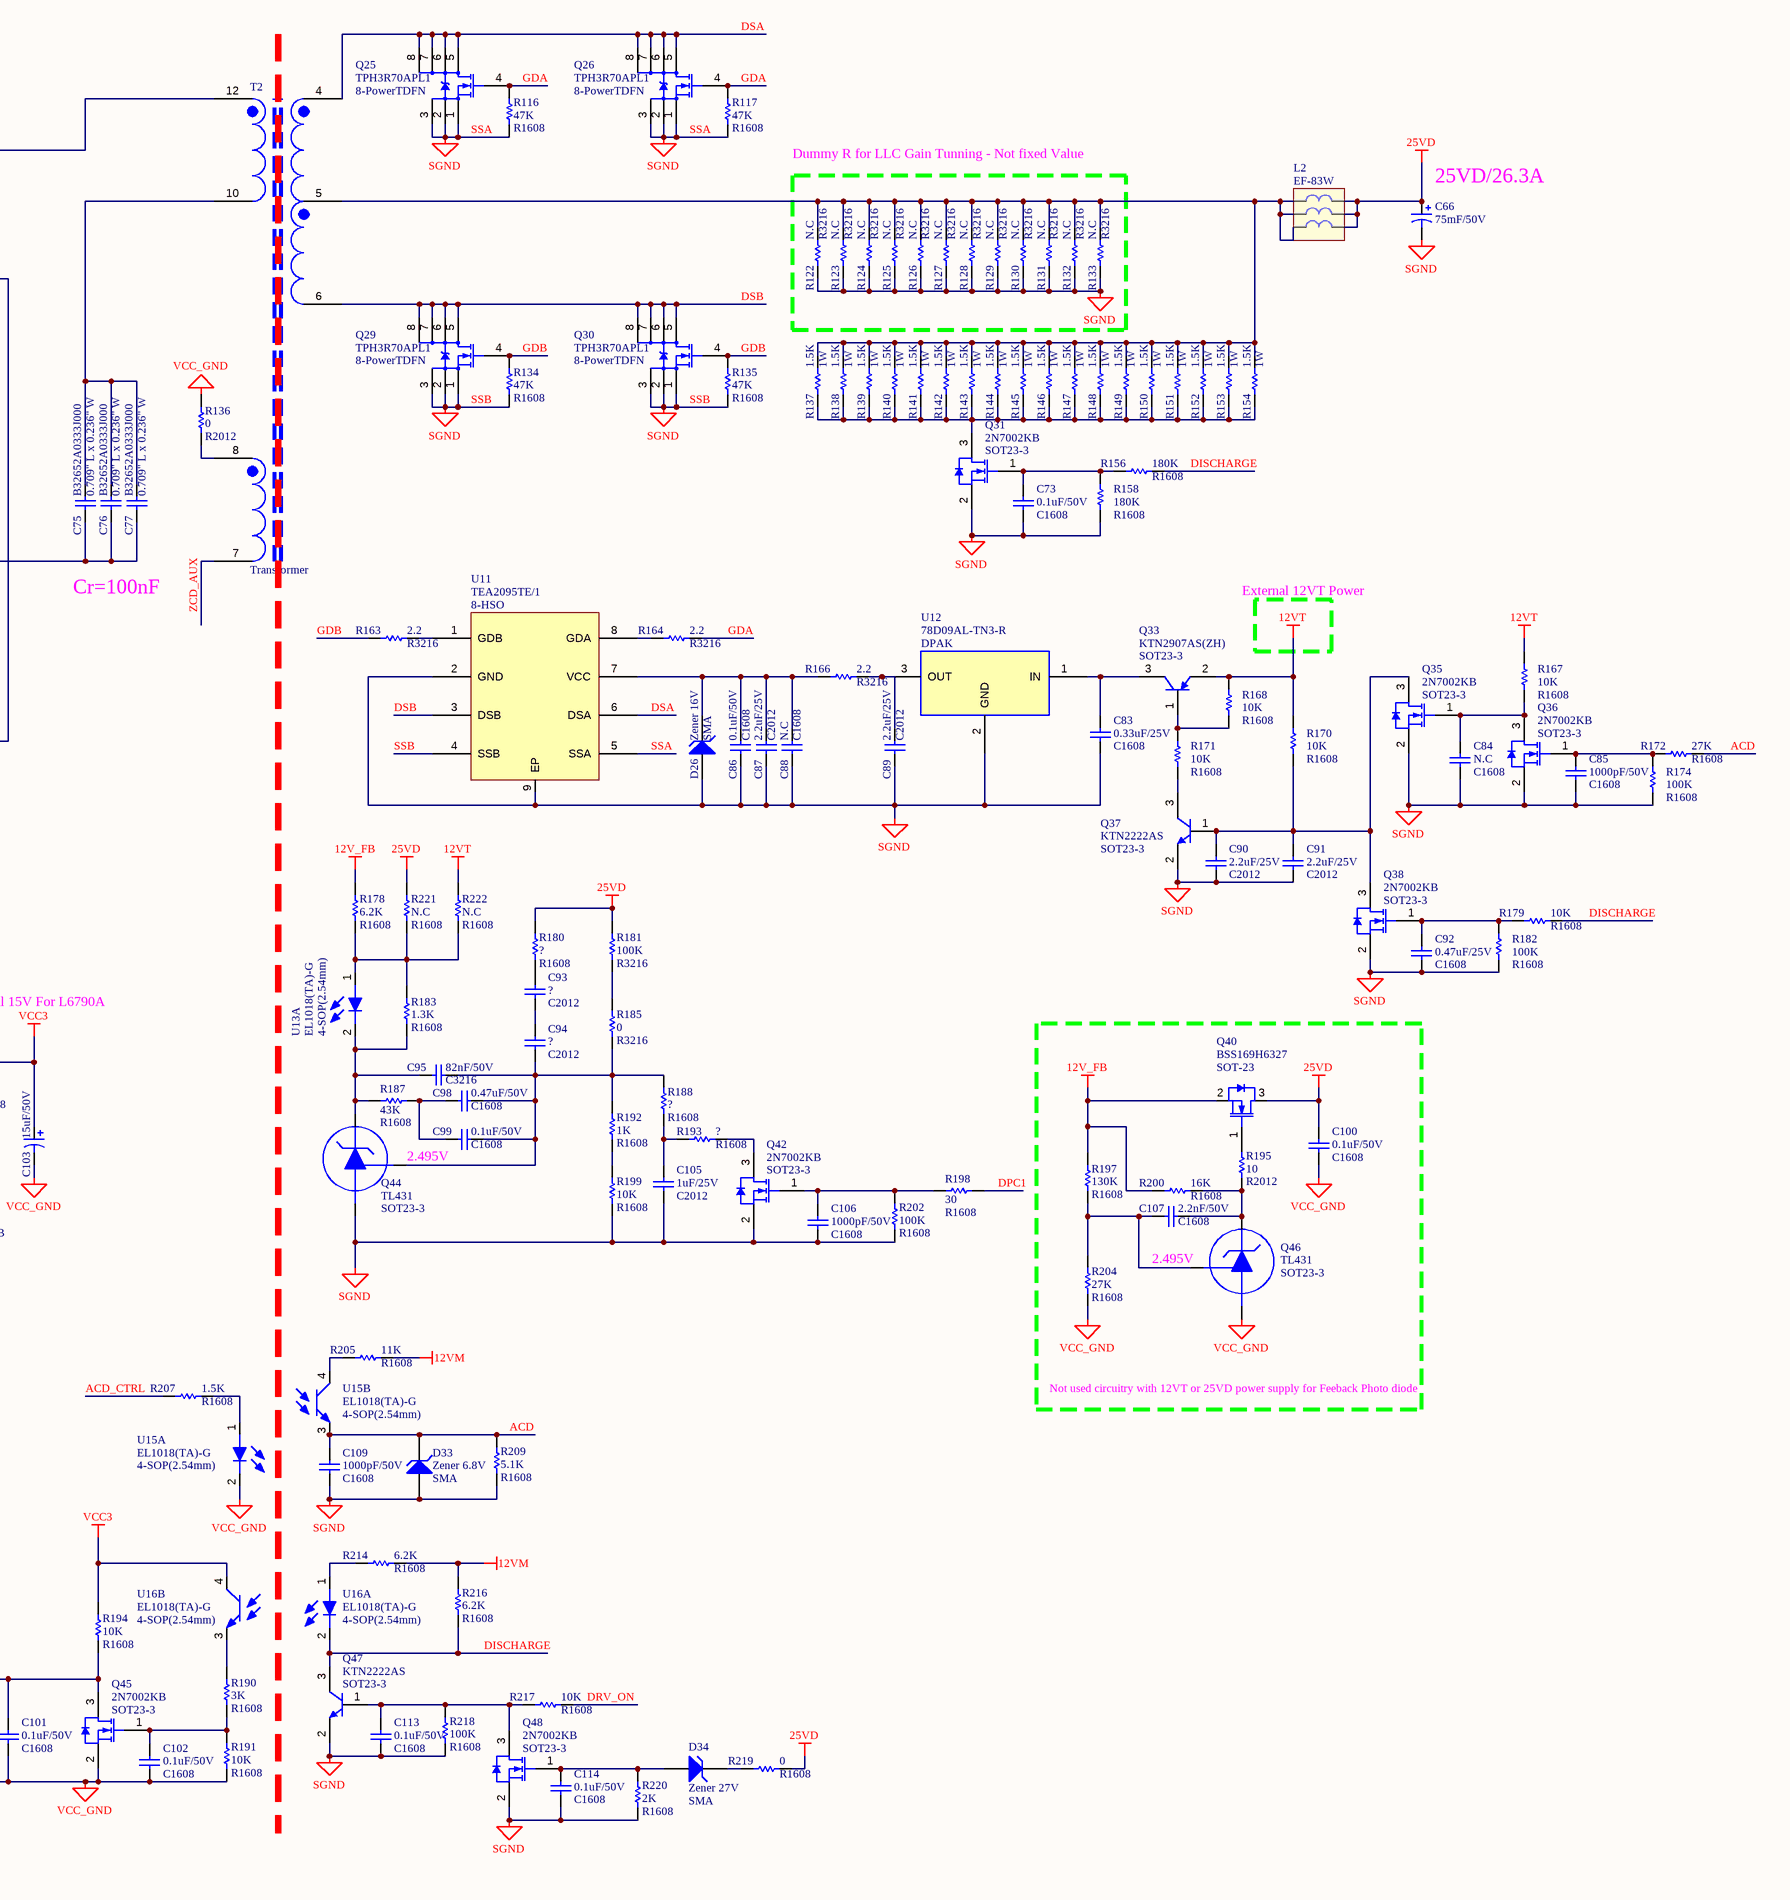
[diagram p6: L6790A_Si.SchDoc, bottom right]

### Parts
BD2  TS6KL60  [2W-DIO-MI-4L-4_6X25X15-7_5P-BD]  (value not drawn)
C61  2200nF/305VAC
C62  0.1uF/50V  Package/Case: C1608
C63  100nF/50V  Package/Case: C2012
C64  N.C  Package/Case: C1608
C65  10uF/50V  Package/Case: C3216
C66  75mF/50V  [1W-CAP-MI-2L-16DX25-7_5P-EL-F-R1212]
C67  N.C  Package/Case: C1608
C68  0.1uF/50V  Package/Case: C1608
C69  22pF/50V  Package/Case: C1608
C70  22pF/50V  Package/Case: C1608
C71  0.1uF/50V  Package/Case: C1608
C72  100nF/50V  Package/Case: C2012
C73  0.1uF/50V  Package/Case: C1608
C74  N.C  Package/Case: C1608
C75  B32652A0333J000  Package/Case: 0.709" L x 0.236" W
C76  B32652A0333J000  Package/Case: 0.709" L x 0.236" W
C77  B32652A0333J000  Package/Case: 0.709" L x 0.236" W
C78  10uF/50V  Package/Case: C3216
C79  N.C  Package/Case: C1608
C80  0.1uF/50V  Package/Case: C1608
C81  22pF/50V  Package/Case: C1608
C82  22pF/50V  Package/Case: C1608
C83  0.33uF/25V  Package/Case: C1608
C84  N.C  Package/Case: C1608
C85  1000pF/50V  Package/Case: C1608
C86  0.1uF/50V  Package/Case: C1608
C87  2.2uF/25V  Package/Case: C2012
C88  N.C  Package/Case: C1608
C89  2.2uF/25V  Package/Case: C2012
C90  2.2uF/25V  Package/Case: C2012
C91  2.2uF/25V  Package/Case: C2012
C92  0.47uF/25V  Package/Case: C1608
C93  ?  Package/Case: C2012
C94  ?  Package/Case: C2012
C95  82nF/50V  Package/Case: C3216  [CAP-CHP-3216-R0]
C96  2.2uF/50V  [CAP-RA-D5.0H12_5-P2-R0CA]
C97  0.1uF/50V  Package/Case: C1608
C98  0.47uF/50V  Package/Case: C1608
C99  0.1uF/50V  Package/Case: C1608
C100  0.1uF/50V  Package/Case: C1608
C101  0.1uF/50V  Package/Case: C1608
C102  0.1uF/50V  Package/Case: C1608
C103  15uF/50V  [CAP-RA-D5.0H12_5-P2-R0CA]
C104  0.1uF/50V  Package/Case: C1608
C105  1uF/25V  Package/Case: C2012
C106  1000pF/50V  Package/Case: C1608
C107  2.2nF/50V  Package/Case: C1608
C108  0.1uF/50V  Package/Case: C1608
C109  1000pF/50V  Package/Case: C1608
C110  470pF/50V/NP0  Package/Case: C1608
C111  1.5nF/50V  Package/Case: C1608
C112  100pF/50V  Package/Case: C1608
C113  0.1uF/50V  Package/Case: C1608
C114  0.1uF/50V  Package/Case: C1608
C115  2.2nF/2kV
C117  2.2nF/2kV
D16  STTH1R06A  Package/Case: SMA  [DIO-SOD123]
D17  1N4148WS  Package/Case: SOD-123  [DIO-SOD123]
D18  1N4148WS  Package/Case: SOD-123  [DIO-SOD123]
D19  1N4148WS  Package/Case: SOD-123  [DIO-SOD123]
D21  STTH1R06A  Package/Case: SMA  [DIO-SOD123]
D22  1N4148WS  Package/Case: SOD-123  [DIO-SOD123]
D24  1N4148WS  Package/Case: SOD-123  [DIO-SOD123]
D26  Zener 16V  Package/Case: SMA  [1W-DIO-CHP-2L-SOD106-SMA]
D27  HS1M  Package/Case: SMA  [DIO-SOD123]
D28  HS1M  Package/Case: SMA  [DIO-SOD123]
D31  HS1M  Package/Case: SMA  [DIO-SOD123]
D32  HS1M  Package/Case: SMA  [DIO-SOD123]
D33  Zener 6.8V  Package/Case: SMA  [1W-DIO-CHP-2L-SOD106-SMA]
D34  Zener 27V  Package/Case: SMA  [1W-DIO-CHP-2L-SOD106-SMA]
L2  EF-83W
Q25  TPH3R70APL1  Package/Case: 8-PowerTDFN
Q26  TPH3R70APL1  Package/Case: 8-PowerTDFN
Q27  STO60N045DM9  Package/Case: TO-LL
Q28  STO60N045DM9  Package/Case: TO-LL
Q29  TPH3R70APL1  Package/Case: 8-PowerTDFN
Q30  TPH3R70APL1  Package/Case: 8-PowerTDFN
Q31  2N7002KB  Package/Case: SOT23-3
Q32  STO60N045DM9  Package/Case: TO-LL
Q33  KTN2907AS(ZH)  Package/Case: SOT23-3
Q34  STO60N045DM9  Package/Case: TO-LL
Q35  2N7002KB  Package/Case: SOT23-3
Q36  2N7002KB  Package/Case: SOT23-3
Q37  KTN2222AS  Package/Case: SOT23-3
Q38  2N7002KB  Package/Case: SOT23-3
Q39  KTN2907AS(ZH)  Package/Case: SOT23-3
Q40  BSS169H6327  Package/Case: SOT-23  [SOT-23_TR]
Q41  2N7002KB  Package/Case: SOT23-3
Q42  2N7002KB  Package/Case: SOT23-3
Q43  2N7002KB  Package/Case: SOT23-3
Q44  TL431  Package/Case: SOT23-3  [SOT-23_TR]
Q45  2N7002KB  Package/Case: SOT23-3
Q46  TL431  Package/Case: SOT23-3  [SOT-23_TR]
Q47  KTN2222AS  Package/Case: SOT23-3
Q48  2N7002KB  Package/Case: SOT23-3
R113  10  Package/Case: R2012  [RES-1608]
R114  10  Package/Case: R1608  [RES-1608]
R115  47  Package/Case: R1608  [RES-1608]
R116  47K  Package/Case: R1608  [RES-1608]
R117  47K  Package/Case: R1608  [RES-1608]
R118  10  Package/Case: R1608  [RES-1608]
R119  10  Package/Case: R1608  [RES-1608]
R120  10  Package/Case: R1608  [RES-1608]
R121  47  Package/Case: R1608  [RES-1608]
R122  N.C  Package/Case: R3216  [RES-3216]
R123  N.C  Package/Case: R3216  [RES-3216]
R124  N.C  Package/Case: R3216  [RES-3216]
R125  N.C  Package/Case: R3216  [RES-3216]
R126  N.C  Package/Case: R3216  [RES-3216]
R127  N.C  Package/Case: R3216  [RES-3216]
R128  N.C  Package/Case: R3216  [RES-3216]
R129  N.C  Package/Case: R3216  [RES-3216]
R130  N.C  Package/Case: R3216  [RES-3216]
R131  N.C  Package/Case: R3216  [RES-3216]
R132  N.C  Package/Case: R3216  [RES-3216]
R133  N.C  Package/Case: R3216  [RES-3216]
R134  47K  Package/Case: R1608  [RES-1608]
R135  47K  Package/Case: R1608  [RES-1608]
R136  0  Package/Case: R2012  [RES-1608]
R137  1.5K  Package/Case: 1W
R138  1.5K  Package/Case: 1W
R139  1.5K  Package/Case: 1W
R140  1.5K  Package/Case: 1W
R141  1.5K  Package/Case: 1W
R142  1.5K  Package/Case: 1W
R143  1.5K  Package/Case: 1W
R144  1.5K  Package/Case: 1W
R145  1.5K  Package/Case: 1W
R146  1.5K  Package/Case: 1W
R147  1.5K  Package/Case: 1W
R148  1.5K  Package/Case: 1W
R149  1.5K  Package/Case: 1W
R150  1.5K  Package/Case: 1W
R151  1.5K  Package/Case: 1W
R152  1.5K  Package/Case: 1W
R153  1.5K  Package/Case: 1W
R154  1.5K  Package/Case: 1W
R155  10  Package/Case: R2012  [RES-1608]
R156  180K  Package/Case: R1608  [RES-1608]
R157  10  Package/Case: R1608  [RES-1608]
R158  180K  Package/Case: R1608  [RES-1608]
R159  47  Package/Case: R1608  [RES-1608]
R160  10  Package/Case: R1608  [RES-1608]
R161  10  Package/Case: R1608  [RES-1608]
R162  10  Package/Case: R1608  [RES-1608]
R163  2.2  Package/Case: R3216  [RES-3216]
R164  2.2  Package/Case: R3216  [RES-3216]
R165  47  Package/Case: R1608  [RES-1608]
R166  2.2  Package/Case: R3216  [RES-3216]
R167  10K  Package/Case: R1608  [RES-1608]
R168  10K  Package/Case: R1608  [RES-1608]
R169  120m  Package/Case: R6432
R170  10K  Package/Case: R1608  [RES-1608]
R171  10K  Package/Case: R1608  [RES-1608]
R172  27K  Package/Case: R1608  [RES-1608]
R173  120m  Package/Case: R6432
R174  100K  Package/Case: R1608  [RES-1608]
R175  120m  Package/Case: R6432
R176  120m  Package/Case: R6432
R177  120m  Package/Case: R6432
R178  6.2K  Package/Case: R1608  [RES-3216]
R179  10K  Package/Case: R1608  [RES-1608]
R180  ?  Package/Case: R1608  [RES-1608]
R181  100K  Package/Case: R3216  [RES-3216]
R182  100K  Package/Case: R1608  [RES-1608]
R183  1.3K  Package/Case: R1608  [RES-1608]
R184  10  Package/Case: R1608  [RES-1608]
R185  0  Package/Case: R3216  [RES-3216]
R186  10K  Package/Case: R1608  [RES-1608]
R187  43K  Package/Case: R1608  [RES-1608]
R188  ?  Package/Case: R1608  [RES-1608]
R189  N.C  Package/Case: R3216  [RES-3216]
R190  3K  Package/Case: R1608  [RES-1608]
R191  10K  Package/Case: R1608  [RES-1608]
R192  1K  Package/Case: R1608  [RES-1608]
R193  ?  Package/Case: R1608  [RES-1608]
R194  10K  Package/Case: R1608  [RES-1608]
R195  10  Package/Case: R2012  [RES-1608]
R196  N.C  Package/Case: R3216  [RES-3216]
R197  130K  Package/Case: R1608  [RES-1608]
R198  30  Package/Case: R1608  [RES-1608]
R199  10K  Package/Case: R1608  [RES-1608]
R200  16K  Package/Case: R1608  [RES-1608]
R201  10K  Package/Case: R1608  [RES-1608]
R202  100K  Package/Case: R1608  [RES-1608]
R203  100K  Package/Case: R1608  [RES-1608]
R204  27K  Package/Case: R1608  [RES-1608]
R205  11K  Package/Case: R1608  [RES-1608]
R206  330K  Package/Case: R1608  [RES-1608]
R207  1.5K  Package/Case: R1608  [RES-1608]
R208  18K  Package/Case: R1608  [RES-1608]
R209  5.1K  Package/Case: R1608  [RES-1608]
R210  1K  Package/Case: R1608  [RES-1608]
R211  30K  Package/Case: R1608  [RES-1608]
R212  30K  Package/Case: R1608  [RES-1608]
R213  1K  Package/Case: R1608  [RES-1608]
R214  6.2K  Package/Case: R1608  [RES-1608]
R215  10K  Package/Case: R1608  [RES-1608]
R216  6.2K  Package/Case: R1608  [RES-1608]
R217  10K  Package/Case: R1608  [RES-1608]
R218  100K  Package/Case: R1608  [RES-1608]
R219  0  Package/Case: R1608  [RES-1608]
R220  2K  Package/Case: R1608  [RES-1608]
R221  N.C  Package/Case: R1608  [RES-3216]
R222  N.C  Package/Case: R1608  [RES-3216]
R223  10K  Package/Case: R1608  [RES-1608]
R224  1K  Package/Case: R1608  [RES-1608]
R225  0  Package/Case: R3216  [RES-1608]
R226  0  Package/Case: R1608  [RES-1608]
R227  N.C  Package/Case: R2012  [RES-1608]
R228  N.C  Package/Case: R2012  [RES-1608]
R229  N.C  Package/Case: R2012  [RES-1608]
R230  N.C  Package/Case: R2012  [RES-1608]
T2  Transformer
U9  L6498LD
U10  L6498LD
U11  TEA2095TE/1  Package/Case: 8-HSO
U12  78D09AL-TN3-R  Package/Case: DPAK
U13  EL1018(TA)-G  Package/Case: 4-SOP(2.54mm)  [1W-IC-CHP-4L-3_6X7_6-2_54P-L10_2-PC]  (parts A,B of 2)
U14  L6790A  Package/Case: SO16N
U15  EL1018(TA)-G  Package/Case: 4-SOP(2.54mm)  [1W-IC-CHP-4L-3_6X7_6-2_54P-L10_2-PC]  (parts A,B of 2)
U16  EL1018(TA)-G  Package/Case: 4-SOP(2.54mm)  [1W-IC-CHP-4L-3_6X7_6-2_54P-L10_2-PC]  (parts A,B of 2)

### Blocks framed on the sheet
Dummy R for LLC Gain Tunning - Not fixed Value: R122-R133
2.495V: C100 C107 Q40 Q46 R195 R197 R200 R204

### Nets
12V_FB: Q40.2(SOURCE) R178.2 R197.1 R200.2
12VM: R205.2 R214.2 R216.2
12VT: Q33.2(E) R167.1 R168.1 R170.1 R222.2
25VD: C66.1 C100.1 L2.2 Q40.3(DRAIN) R180.2 R181.1 R219.2 R221.2
BOOT1: C63.1 R113.2 U9.13(BOOT)
BOOT2: C72.1 R155.2 U10.13(BOOT)
ISEN: BD2.4 C61.1 D27.2(K) R169.2 R173.2 R175.2 R176.2 R177.2 R226.1  [also labelled VRECT_NEG]
POWER_GND: C62.1 C68.2 C69.2 C70.2 C71.1 C80.2 C81.2 C82.2 C96.2 C97.2 C100.2 C101.2 C102.2 C103.2 C104.2 C108.2 C110.2 C111.2 C112.2 C115.2 C117.2 D28.1(A) Q28.3(PS) Q28.4(PS) Q28.5(PS) Q28.6(PS) Q28.7(PS) Q28.8(PS) Q34.3(PS) Q34.4(PS) Q34.5(PS) Q34.6(PS) Q34.7(PS) Q34.8(PS) Q41.2(S) Q43.2(S) Q45.2(S) Q46.3(A) R136.2 R169.1 R173.1 R175.1 R176.1 R177.1 R189.2 R191.2 R201.2 R203.2 R204.2 R211.2 R212.2 R213.2 R215.2 R228.2 R230.2 U9.3(SGND) U10.3(SGND) U13.3(E) U14.5(GND) U15.2(C)  [also labelled VCC_GND]
SSA: C66.2 C73.2 C83.2 C84.2 C85.2 C86.2 C87.2 C88.2 C89.2 C90.2 C91.2 C92.2 C105.2 C106.2 C109.2 C113.1 C114.1 D26.1(A) D33.1(A) Q25.1(S) Q25.2(S) Q25.3(S) Q26.1(S) Q26.2(S) Q26.3(S) Q29.1(S) Q29.2(S) Q29.3(S) Q30.1(S) Q30.2(S) Q30.3(S) Q31.2(S) Q35.2(S) Q36.2(S) Q37.2(E) Q38.2(S) Q42.2(S) Q44.3(A) Q47.2(E) Q48.2(S) R116.2 R117.2 R122.1 R123.1 R124.1 R125.1 R126.1 R127.1 R128.1 R129.1 R130.1 R131.1 R132.1 R133.1 R134.2 R135.2 R158.2 R174.2 R182.2 R199.2 R202.1 R209.1 R218.1 R220.1 U11.2(GND) U11.4(SSB) U11.5(SSA) U11.9(EP) U12.2(GND)  [also labelled SGND, SSB]
VCC3: C103.1 D18.1(A) Q39.2(E) R186.1 R194.1 U16.4(C)
VCC_GD: C62.2 C65.1 C68.1 C71.2 C78.1 C80.1 C96.1 C97.1 D16.1(A) D21.1(A) Q39.3(C) U9.7(VCC) U10.7(VCC)
VCC_IC: C108.1 D18.2(K) U14.4(VCC)
VRECT_POS: BD2.1 C61.2 C115.1 C117.1 Q27.TAP(D) Q32.TAP(D)
ACD: C109.1 D33.2(K) R172.2 R209.2 U15.3(E)
ACD_CTRL: R207.2
ACL: BD2.3 D31.1(A)
ACN: BD2.2 D32.1(A)
BM: R211.1 U14.10(BM)
CFG: R212.1 U14.11(CFG)
CT: C110.1 U14.8(CT)
DISCHARGE: Q47.3(C) R156.2 R179.2 R216.1 U16.2(C)
DPC1: R198.2
DRV_EN: R224.1 U14.3(DRV_EN)
DRV_ON: R217.2
DSA: Q25.5(D) Q25.6(D) Q25.7(D) Q25.8(D) Q26.5(D) Q26.6(D) Q26.7(D) Q26.8(D) T2.4 U11.6(DSA)
DSB: Q29.5(D) Q29.6(D) Q29.7(D) Q29.8(D) Q30.5(D) Q30.6(D) Q30.7(D) Q30.8(D) T2.6 U11.3(DSB)
FB: C111.1 C112.1 U13.4(C) U14.9(FB)
GDA: Q25.4(G) Q26.4(G) R116.1 R117.1 R164.1
GDB: Q29.4(G) Q30.4(G) R134.1 R135.1 R163.2
HOUT1: R118.1 U14.16(HOUT1)
HOUT2: R160.1 U14.14(HOUT2)
LOUT1: R119.1 U14.15(LOUT1)
LOUT2: R161.1 U14.13(LOUT2)
OUTb_1: C63.2 C64.2 Q27.2(DS) R227.1 U9.11(OUT)
OUTb_2: C72.2 C74.2 Q32.2(DS) R229.1 U10.11(OUT)
OUTH_1: D17.2(K) R115.2 U9.12(HVG)
OUTH_2: D22.2(K) R159.2 U10.12(HVG)
OUTL_1: D19.2(K) R121.2 U9.6(LVG)
OUTL_2: D24.2(K) R165.2 U10.6(LVG)
PGND_1: C65.2 C67.2 Q28.2(DS) R228.1 U9.5(PGND)
PGND_2: C78.2 C79.2 Q34.2(DS) R230.1 U10.5(PGND)
RT: R184.2 R210.1 U14.7(RT)
ZCD: R206.2 R208.1 U14.12(ZCD)
ZCD_AUX: R206.1 T2.7
NetC64_1: C64.1 Q27.1(G) R114.1 R115.1
NetC67_1: C67.1 Q28.1(G) R120.1 R121.1
NetC69_1: C69.1 R118.2 U9.1(HIN)
NetC70_1: C70.1 R119.2 U9.2(LIN)
NetC73_1: C73.1 Q31.1(G) R156.1 R158.1
NetC74_1: C74.1 Q32.1(G) R157.1 R159.1
NetC75_1: C75.1 C76.1 C77.1 T2.10
NetC75_2: C75.2 C76.2 C77.2 Q32.3(PS) Q32.4(PS) Q32.5(PS) Q32.6(PS) Q32.7(PS) Q32.8(PS) Q34.TAP(D) R229.2
NetC79_1: C79.1 Q34.1(G) R162.1 R165.1
NetC81_1: C81.1 R160.2 U10.1(HIN)
NetC82_1: C82.1 R161.2 U10.2(LIN)
NetC83_1: C83.1 Q33.3(C) U12.1(IN)
NetC84_1: C84.1 Q35.1(G) Q36.3(D) R167.2
NetC85_1: C85.1 Q36.1(G) R172.1 R174.1
NetC86_1: C86.1 C87.1 C88.1 D26.2(K) R166.2 U11.7(VCC)
NetC89_1: C89.1 R166.1 U12.3(OUT)
NetC90_1: C90.1 C91.1 Q35.3(D) Q37.1(B) Q38.3(D) R170.2
NetC92_1: C92.1 Q38.1(G) R179.1 R182.1
NetC93_1: C93.1 R180.1
NetC93_2: C93.2 C94.1
NetC94_2: C94.2 C95.1 C98.1 C99.1 Q44.1(R) R185.2 R188.2 R192.1
NetC95_2: C95.2 Q44.2(K) R183.2 R187.1 U13.2(C)
NetC98_2: C98.2 C99.2 R187.2
NetC101_1: C101.1 Q43.1(G) Q45.3(D) R194.2 R203.1
NetC102_1: C102.1 Q45.1(G) R190.2 R191.1
NetC104_1: C104.1 Q41.1(G) R201.1 R224.2
NetC105_1: C105.1 R188.1 R193.1
NetC106_1: C106.1 Q42.1(G) R198.1 R202.2
NetC107_1: C107.1 Q46.1(R) R197.2 R204.1
NetC107_2: C107.2 Q46.2(K) R195.2 R200.1
NetC113_2: C113.2 Q47.1(B) Q48.3(D) R217.1 R218.2
NetC114_2: C114.2 D34.1(A) Q48.1(G) R220.2
NetD16_2: D16.2(K) R113.1
NetD17_1: D17.1(A) R114.2
NetD19_1: D19.1(A) R120.2
NetD21_2: D21.2(K) R155.1
NetD22_1: D22.1(A) R157.2
NetD24_1: D24.1(A) R162.2
NetD27_1: D27.1(A) D28.2(K)
NetD31_2: D31.2(K) D32.2(K) R196.1 R225.2
NetD34_2: D34.2(K) R219.1
NetL2_1: L2.1 R122.2 R123.2 R124.2 R125.2 R126.2 R127.2 R128.2 R129.2 R130.2 R131.2 R132.2 R133.2 R137.2 R138.2 R139.2 R140.2 R141.2 R142.2 R143.2 R144.2 R145.2 R146.2 R147.2 R148.2 R149.2 R150.2 R151.2 R152.2 R153.2 R154.2 T2.5
NetQ27_3: Q27.3(PS) Q27.4(PS) Q27.5(PS) Q27.6(PS) Q27.7(PS) Q27.8(PS) Q28.TAP(D) R227.2 T2.12
NetQ31_3: Q31.3(D) R137.1 R138.1 R139.1 R140.1 R141.1 R142.1 R143.1 R144.1 R145.1 R146.1 R147.1 R148.1 R149.1 R150.1 R151.1 R152.1 R153.1 R154.1
NetQ33_1: Q33.1(B) R168.2 R171.1
NetQ37_3: Q37.3(C) R171.2
NetQ39_1: Q39.1(B) R186.2 R223.1
NetQ40_1: Q40.1(GATE) R195.1
NetQ41_3: Q41.3(D) R223.2
NetQ42_3: Q42.3(D) R193.2
NetQ43_3: Q43.3(D) R184.1
NetR136_1: R136.1 T2.8
NetR163_1: R163.1 U11.1(GDB)
NetR164_2: R164.2 U11.8(GDA)
NetR178_1: R178.1 R183.1 R221.1 R222.1 U13.1(A)
NetR181_2: R181.2 R185.1
NetR189_1: R189.1 R196.2
NetR190_1: R190.1 U16.3(E)
NetR192_2: R192.2 R199.1
NetR205_1: R205.1 U15.4(C)
NetR207_1: R207.1 U15.1(A)
NetR208_2: R208.2 R213.1
NetR210_2: R210.2 R215.1
NetR214_1: R214.1 U16.1(A)
NetR225_1: R225.1 U14.1(HVSU)
NetR226_2: R226.2 U14.6(ISEN)

Not connected (* = marked no-connect by the designer): U9 4(NC)* 8(NC)* 9(NC)* 10(NC)* 14(NC)*; U10 4(NC)* 8(NC)* 9(NC)* 10(NC)* 14(NC)*; U14 2(NC)*

### Notes on the sheet
- (near C66) 25VD/26.3A
- Cr=100nF
- External 12VT Power
- Close to L6790A STAR Connection
- Not used circuitry with external VCC power
- For Gate Drivers
- External 15V For L6790A
- 2.495V
- Not used circuitry with 12VT or 25VD power supply for Feeback Photo diode
- DWG NO:
- REV:
- THIS DOCUMENT AND THE DATA DISCLOSED HEREIN OR
- HEREWITH IS THE PROPERTY OF ALTIUM LIMITED AND MAY
- BE FREELY DISTRIBUTED IN WHOLE. NO RIGHTS ARE
- RESERVED OR EXPRESS OR IMPLIED WARANTEE GIVEN.
- REVISION
- DESCRIPTION
- DATE
- APPROVED
- ENG:
- APPROVALS
- PROJECT
- DSN:
- CHK:
- REFERENCE DOCUMENTS
- PROJECT REVISION:
- TITLE
- DOCUMENT REVISION:
- DESIGN ITEM:
- BOM:
- FAB DWG:
- PCB DWG:
- ASSY DWG:
- SCALE:
- A2
- SIZE
- CAGE CODE
- FILE NAME
- DWG NO.
- SHEET
- OF
- REV

### Library data of the parts
BD2 = BRIDGE: BRIDGE DIODE; Mount Type: DIP
C61-C65 C67-C95 C97-C102 C104-C115 C117 = Cap: Chip MLCC
  C61-C65 C67-C92 C97 C100-C102 C104 C106-C115 C117: Mounting Type: SMD
  C93-C95 C98 C99 C105: Mount Type: SMD
C66 = Cap Pol1: Electrolytic Capacitor; Mount Type: DIP
C96 C103 = Cap Pol1: Electrolytic Capacitor 33uF/25V; Mount Type: DIP
D16-D19 D21 D22 D24 D27 D28 D31 D32 = Diode 1N4148: DIODE SCHOTTKY 30V 200MA SOD123; Mount Type: SMD
D26 D33 D34 = D Zener: DIODE ZENER 30V 1W DO214AC; Mount Type: SMD
Q25 Q26 Q29 Q30 = TPH3R70APL1: as Q2 on sheet L6790A_GaN; Mount Type: SMD
Q27 Q28 Q32 Q34 = STO60N045DM9: N‑channel 600 V, 35 mΩ typ., 56 A MDmesh DM9 Power MOSFET in a TO‑LL package; Mount Type: SMD
Q31 Q35 Q36 Q38 Q41-Q43 Q45 Q48 = 2N7002KB: N-CH MOSFET; Mounting Type: SMD
Q33 Q39 = ONSC-PNP-B1E2C3-3: PNP BJT; Mounting Type: SMD
Q37 Q47 = ONSC-NPN-B1E2C3-3: BJT NPN; Mounting Type: SMD
Q40 = CMP-32901-000982-1: MOSFET N-CH 100V 170MA SOT23-3; Mount Type: SMD
Q44 Q46 = 1W-IC-CHP-3L-SOT23-SCR-R0: IC VREF SHUNT ADJ 1% SOT23-3; Mount Type: SMD
R113-R136 R155-R230 = Res1: Chip Resistor; Mount Type: SMD
R137-R154 = Res1: Watt Resistor; Mount Type: SMD
U11 = TEA2095TE/1: LLC SR CONTROLLER IC; Mounting Type: SMD
U12 = 78D09AL-TN3-R: as U3 on sheet L6790A_GaN; Mounting Type: SMD
U13 U15 U16 = SFH617A-2X019T: Photocoupler; Mount Type: SMD
U14 = L6790A: as U6 on sheet L6790A_GaN; Mounting Type: SMD
T2 = Transformer: Mount Type: DIP

## Nets that join several sheets
12V_FB: L6790A_GaN (Q23.2 R72.2 R109.1 R110.2), L6790A_Si (Q40.2 R178.2 R197.1 R200.2)
12VM: L6790A_GaN (R97.2 R103.2 R104.2), L6790A_Si (R205.2 R214.2 R216.2)
12VT: L6790A_GaN (Q9.2 R57.1 R58.1 R62.1), L6790A_Si (5 pins)
25VD: L6790A_GaN (7 pins), L6790A_Si (8 pins)
BOOT1: L6790A_GaN (C5.1 R1.2 U1.18), L6790A_Si (C63.1 R113.2 U9.13)
BOOT2: L6790A_GaN (C18.1 R46.2 U4.18), L6790A_Si (C72.1 R155.2 U10.13)
ISEN: L6790A_GaN (9 pins), L6790A_Si (9 pins)
POWER_GND: L6790A_GaN (63 pins), L6790A_Si (60 pins)
SSA: L6790A_GaN (69 pins), L6790A_Si (69 pins)
VCC3: L6790A_GaN (U8.4), L6790A_Si (6 pins)
VCC_GD: L6790A_GaN (13 pins), L6790A_Si (13 pins)
VCC_IC: L6790A_GaN (9 pins), L6790A_Si (C108.1 D18.2 U14.4)
VRECT_POS: L6790A_GaN (10 pins), L6790A_Si (6 pins)
ACD: L6790A_GaN (5 pins), L6790A_Si (5 pins)
ACD_CTRL: L6790A_GaN (R96.2), L6790A_Si (R207.2)
ACL: L6790A_GaN (BD1.3 D6.1), L6790A_Si (BD2.3 D31.1)
ACN: L6790A_GaN (BD1.2 D7.1), L6790A_Si (BD2.2 D32.1)
BM: L6790A_GaN (R98.1 U6.10), L6790A_Si (R211.1 U14.10)
CFG: L6790A_GaN (R99.1 U6.11), L6790A_Si (R212.1 U14.11)
DISCHARGE: L6790A_GaN (5 pins), L6790A_Si (5 pins)
DPC1: L6790A_GaN (R88.2), L6790A_Si (R198.2)
DRV_EN: L6790A_GaN (5 pins), L6790A_Si (R224.1 U14.3)
DRV_ON: L6790A_GaN (R105.2), L6790A_Si (R217.2)
DSA: L6790A_GaN (10 pins), L6790A_Si (10 pins)
DSB: L6790A_GaN (10 pins), L6790A_Si (10 pins)
FB: L6790A_GaN (C54.1 C55.1 U5.4 U6.9), L6790A_Si (C111.1 C112.1 U13.4 U14.9)
GDA: L6790A_GaN (5 pins), L6790A_Si (5 pins)
GDB: L6790A_GaN (5 pins), L6790A_Si (5 pins)
HOUT1: L6790A_GaN (R9.1 U6.16), L6790A_Si (R118.1 U14.16)
HOUT2: L6790A_GaN (R59.1 U6.14), L6790A_Si (R160.1 U14.14)
LOUT1: L6790A_GaN (R11.1 U6.15), L6790A_Si (R119.1 U14.15)
LOUT2: L6790A_GaN (R61.1 U6.13), L6790A_Si (R161.1 U14.13)
OUTb_1: L6790A_GaN (5 pins), L6790A_Si (5 pins)
OUTb_2: L6790A_GaN (5 pins), L6790A_Si (5 pins)
OUTH_1: L6790A_GaN (R4.2 U1.15), L6790A_Si (D17.2 R115.2 U9.12)
OUTH_2: L6790A_GaN (R51.2 U4.15), L6790A_Si (D22.2 R159.2 U10.12)
OUTL_1: L6790A_GaN (R10.2 U1.13), L6790A_Si (D19.2 R121.2 U9.6)
OUTL_2: L6790A_GaN (R60.2 U4.13), L6790A_Si (D24.2 R165.2 U10.6)
PGND_1: L6790A_GaN (C8.2 C9.1 Q4.7 U1.12), L6790A_Si (5 pins)
PGND_2: L6790A_GaN (C24.2 C31.1 Q11.7 U4.12), L6790A_Si (5 pins)
ZCD: L6790A_GaN (R92.2 R94.1 U6.12), L6790A_Si (R206.2 R208.1 U14.12)
ZCD_AUX: L6790A_GaN (D4.1 R92.1 T1.7), L6790A_Si (R206.1 T2.7)